# EAGLE design SIM5320_3G_Breakout (EAGLE 9.1.3)
COMPANY: ADAFRUIT INDUSTRIES; DRAWN: KTOWN; REV: A
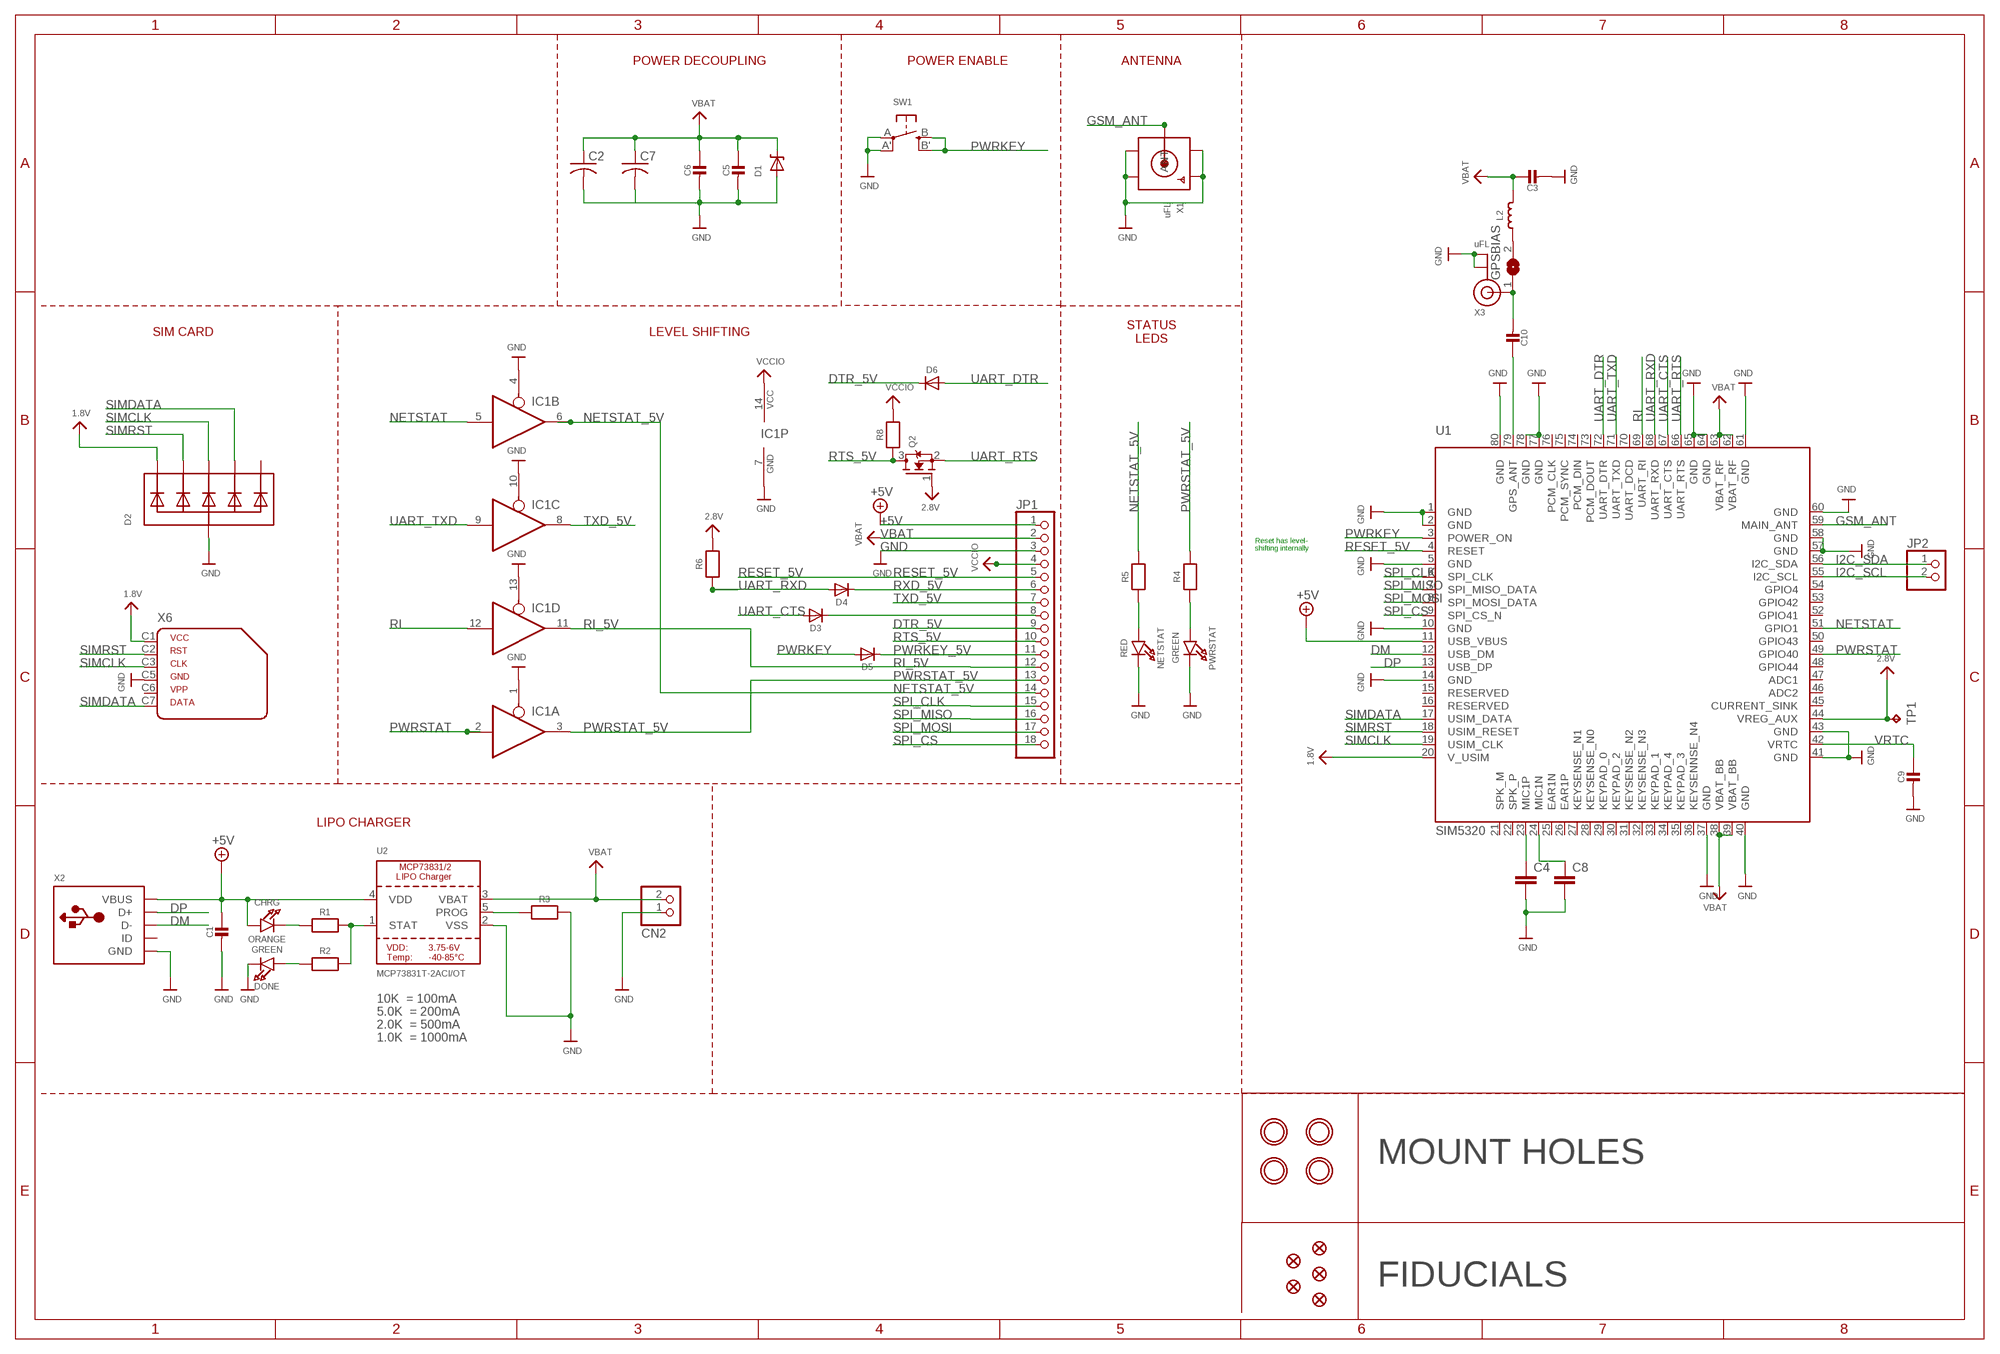
[diagram p0: schematic, sheet 1]

## Parts
C1  CAP_CERAMIC0805-NOOUTLINE  [0805-NO]
C2  C-USC1210  [C1210]
C3  CAP_CERAMIC0805-NOOUTLINE  [0805-NO]
C4  C-EUC1210  [C1210]
C5  CAP_CERAMIC0805-NOOUTLINE  [0805-NO]
C6  CAP_CERAMIC0805-NOOUTLINE  [0805-NO]
C7  C-USC1210  [C1210]
C8  C-EUC1210  [C1210]
C9  CAP_CERAMIC0805-NOOUTLINE  [0805-NO]
C10  CAP_CERAMIC0805-NOOUTLINE  [0805-NO]
CHRG  ORANGE  LED0805_NOOUTLINE  [CHIPLED_0805_NOOUTLINE]
CN2  JST_2PIN  [JSTPH2]
D1  DIODE-ZENERSOD123  [SOD-123]
D2  TVSARRAY_5LANE  [SOT363]
D3  DIODESOD-323  [SOD-323]
D4  DIODESOD-323  [SOD-323]
D5  DIODESOD-323  [SOD-323]
D6  DIODESOD-323  [SOD-323]
DONE  GREEN  LED0805_NOOUTLINE  [CHIPLED_0805_NOOUTLINE]
FID1  FIDUCIAL""  [FIDUCIAL_1MM]
FID2  FIDUCIAL""  [FIDUCIAL_1MM]
FID3  FIDUCIAL""  [FIDUCIAL_1MM]
FID4  FIDUCIAL""  [FIDUCIAL_1MM]
FID5  FIDUCIAL""  [FIDUCIAL_1MM]
GPSBIAS  SOLDERJUMPER  [SOLDERJUMPER_ARROW_NOPASTE]
IC1  74ABT125PW  [TSSOP14]
JP1  HEADER-1X18  [1X18_ROUND70]
JP2  HEADER-1X2ROUND  [1X02_ROUND]
L2  INDUCTOR_0805MP  [_0805MP]
NETSTAT  RED  LED0805_NOOUTLINE  [CHIPLED_0805_NOOUTLINE]
PWRSTAT  GREEN  LED0805_NOOUTLINE  [CHIPLED_0805_NOOUTLINE]
Q2  MOSFET-NWIDE  [SOT23-WIDE]
R1  RESISTOR0805_NOOUTLINE  [0805-NO]
R2  RESISTOR0805_NOOUTLINE  [0805-NO]
R3  RESISTOR0805_NOOUTLINE  [0805-NO]
R4  RESISTOR0805_NOOUTLINE  [0805-NO]
R5  RESISTOR0805_NOOUTLINE  [0805-NO]
R6  RESISTOR0805_NOOUTLINE  [0805-NO]
R8  RESISTOR0805_NOOUTLINE  [0805-NO]
SW1  SWITCH_TACT_SMT4.6X2.8  [BTN_KMR2_4.6X2.8]
TP1  TPTP11R  [TP11R]
U1  SIM5320  GSM_SIM5320_LITERAL  [SIM5320]
U2  MCP73831T-2ACI/OT  MCP73831/2  [SOT23-5]
U$32  MOUNTINGHOLE2.5  [MOUNTINGHOLE_2.5_PLATED]
U$33  MOUNTINGHOLE2.5  [MOUNTINGHOLE_2.5_PLATED]
U$34  MOUNTINGHOLE2.5  [MOUNTINGHOLE_2.5_PLATED]
U$43  MOUNTINGHOLE2.5  [MOUNTINGHOLE_2.5_PLATED]
X1  uFL  SMACONNECTOR_EDGE_UFL  [SMA_EDGELAUNCH_UFL]
X2  USBMICRO_20329  [4UCONN_20329]
X3  uFL  ANTENNA_U.FL  [U.FL]
X6  SIM_LOCKAMPHENOL  [C707_10M006_512_2]

## Nets
1.8V: D2.1(C1) U1.20(V_USIM) X6.C1
2.8V: Q2.1(G) R6.2 TP1.TP U1.44(VREG_AUX)
+5V: C1.1 CHRG.A JP1.1 U1.11(USB_VBUS) U2.4(VDD) X2.VBUS
CTS_5V: D3.C JP1.8
DM: U1.12(USB_DM) X2.D-
DP: U1.13(USB_DP) X2.D+
DTR_5V: D6.C JP1.9
GND: C1.2 C2.2 C3.2 C4.2 C5.2 C6.2 C7.2 C8.2 C9.2 CN2.1 D1.A D2.2(A) DONE.C IC1.1(A:OE) IC1.4(B:OE) IC1.7(P:GND) IC1.10(C:OE) IC1.13(D:OE) JP1.3 NETSTAT.C PWRSTAT.C R3.2 SW1.A'(P1) SW1.A(P) U1.1(GND) U1.2(GND) U1.5(GND) U1.10(GND) U1.14(GND) U1.37(GND) U1.40(GND) U1.41(GND) U1.43(GND) U1.57(GND) U1.58(GND) U1.60(GND) U1.61(GND) U1.64(GND) U1.65(GND) U1.77(GND) U1.78(GND) U1.80(GND) U2.2(VSS) X1.GND@1(GND1) X1.GND@2(GND2) X1.GND@3(GND3) X1.GND@4(GND4) X2.BASE@1(GND) X2.BASE@2(GND) X2.GND X2.SPRT@1(GND) X2.SPRT@2(GND) X2.SPRT@3(GND) X2.SPRT@4(GND) X3.1(GND) X3.2(GND) X6.C5
GSM_ANT: U1.59(MAIN_ANT) X1.P(ANT)
I2C_SCL: JP2.2 U1.55(I2C_SCL)
I2C_SDA: JP2.1 U1.56(I2C_SDA)
N$1: CHRG.C R1.1
N$2: R1.2 R2.2 U2.1(STAT)
N$3: C10.2 GPSBIAS.1 X3.3(SIGNAL)
N$4: PWRSTAT.A R4.1
N$5: R3.1 U2.5(PROG)
N$6: DONE.A R2.1
N$7: C10.1 U1.79(GPS_ANT)
N$8: C4.1 U1.23(MIC1P)
N$9: NETSTAT.A R5.1
N$10: C8.1 U1.24(MIC1N)
N$31: GPSBIAS.2 L2.1
NETSTAT: IC1.5(B:I) U1.51(GPIO1)
NETSTAT_5V: IC1.6(B:O) JP1.14 R5.2
PWRKEY: D5.A SW1.B'(S1) SW1.B(S) U1.3(POWER_ON)
PWRKEY_5V: D5.C JP1.11
PWRSTAT: IC1.2(A:I) U1.49(GPIO40)
PWRSTAT_5V: IC1.3(A:O) JP1.13 R4.2
RESET_5V: JP1.5 U1.4(RESET)
RI: IC1.12(D:I) U1.69(UART_RI)
RI_5V: IC1.11(D:O) JP1.12
RTS_5V: JP1.10 Q2.3(D) R8.1
RXD_5V: D4.C JP1.6
SIMCLK: D2.4(C3) U1.19(USIM_CLK) X6.C3
SIMDATA: D2.5(C4) U1.17(USIM_DATA) X6.C7
SIMRST: D2.3(C2) U1.18(USIM_RESET) X6.C2
SPI_CLK: JP1.15 U1.6(SPI_CLK)
SPI_CS: JP1.18 U1.9(SPI_CS_N)
SPI_MISO: JP1.16 U1.7(SPI_MISO_DATA)
SPI_MOSI: JP1.17 U1.8(SPI_MOSI_DATA)
TXD_5V: IC1.8(C:O) JP1.7
UART_CTS: D3.A U1.67(UART_CTS)
UART_DTR: D6.A U1.72(UART_DTR)
UART_RTS: Q2.2(S) U1.66(UART_RTS)
UART_RXD: D4.A R6.1 U1.68(UART_RXD)
UART_TXD: IC1.9(C:I) U1.71(UART_TXD)
VBAT: C2.1 C3.1 C5.1 C6.1 C7.1 CN2.2 D1.C JP1.2 L2.2 U1.38(VBAT_BB) U1.39(VBAT_BB) U1.62(VBAT_RF) U1.63(VBAT_RF) U2.3(VBAT)
VCCIO: IC1.14(P:VCC) JP1.4 R8.2
VRTC: C9.1 U1.42(VRTC)
Unconnected: D2.6(C5) U1.15(RESERVED) U1.16(RESERVED) U1.21(SPK_M) U1.22(SPK_P) U1.25(EAR1N) U1.26(EAR1P) U1.27(KEYSENSE_N1) U1.28(KEYSENSE_N0) U1.29(KEYPAD_0) U1.30(KEYPAD_2) U1.31(KEYSENSE_N2) U1.32(KEYSENSE_N3) U1.33(KEYPAD_1) U1.34(KEYPAD_4) U1.35(KEYPAD_3) U1.36(KEYSENNSE_N4) U1.45(CURRENT_SINK) U1.46(ADC2) U1.47(ADC1) U1.48(GPIO44) U1.50(GPIO43) U1.52(GPIO41) U1.53(GPIO42) U1.54(GPIO4) U1.70(UART_DCD) U1.73(PCM_DOUT) U1.74(PCM_DIN) U1.75(PCM_SYNC) U1.76(PCM_CLK) X2.ID X6.C6

## Notes on the sheet
- POWER DECOUPLING | POWER ENABLE | ANTENNA
- SIM CARD | LEVEL SHIFTING
- STATUS
  LEDS
- Reset has level-
  shifting internally
- LIPO CHARGER
- 10K  = 100mA
- 5.0K  = 200mA
- 2.0K  = 500mA
- 1.0K  = 1000mA
- MOUNT HOLES
- FIDUCIALS

## Library data of the parts
C1 C3 C5 C6 C9 C10 = microbuilder:CAP_CERAMIC: Ceramic Capacitors For new designs, use the packages preceded by an '_' character since they are more reliable: The following footprints should be used on most boards: _0402 - Standard footprint for regular board layouts _0603 - Standard footprint for regular board layouts _0805 - Standard footprint for regular board layouts _1206 - Standard footprint for regular board layouts For extremely tight-pitch boards where space is at a premium, the following 'micro-pitch' footprints can be used (smaller pads, no silkscreen outline, etc.): _0402MP - Micro-pitch footprint for very dense/compact boards _0603MP - Micro-pitch footprint for very dense/compact boards _0805MP - Micro-pitch footprint for very dense/compact boards _1206MP - Micro-pitch footprint for very dense/compact boards
C2 C7 = rcl:C-US: CAPACITOR, American symbol
C4 C8 = rcl:C-EU: CAPACITOR, European symbol; SPICEPREFIX: C
CHRG DONE NETSTAT PWRSTAT = microbuilder:LED: LED 0603 - 0603 Surface Mount Package 2mA: Green LED - Low Power (3.9mcd, 2ma, 1.7Vf) - Digikey: 475-2709-2-ND Orange LED - Low Power (9.8mcd, 2ma, 1.8Vf) - Digikey: 475-1194-2-ND Red LED - Low Power (5mcd, 2ma, 1.8Vf) - Digikey: 475-1195-2-ND Yellow LED - Low Power (7mcd, 2ma, 1.8Vf) - Digikey: 475-1196-2-ND 5mA: Blue LED - Low Power (17mcd, 5ma, 2.9Vf) - Digikey: LNJ937W8CRACT-ND 0805 - 0805 Surface Mount Package 2mA: Red LED (8.8mcd, 2mA, 1.8Vf, Clear) - Low Power [Digikey: 475-2510-1-ND] Green LED (5mcd, 2mA, 1.8Vf, Clear) - Low Power [Digikey: 475-2730-1-ND] Yellow LED (11.3mcd, 2mA, 1.8Vf, Clear) - Low Power [Digikey: 475-2555-1-ND] 20mA: Red LED (104mcd, 20mA, Diffused) - LS R976 [Digikey: 475-1278-6-ND] Red LED (12mcd, 20mA, 2.0Vf, Clear) - APT2012EC [Digikey: 754-1128-1-ND] Green LED (15mcd, 20mA, 2.2Vf, Clear) - APT2012GC [Digikey: 754-1131-1-ND] Orange LED (160mcd, 20mA, 2.1Vf, Clear) - APT2012SECK [Digikey: 754-1130-1-ND] 1206 - 1206 Surface Mount Package Green LED (26mcd, 20mA, Diffused) - LG N971 [Digikey: 475-1407-6-ND] Red LED (15mcd, 20mA, Diffused) - LH N974 [Digikey: 475-1416-6-ND] Cree - Cree High-Power Surface Mount LEDs XPEBWT-L1-0000-00D50 - White 111lm 350mA 2.9Vf 6200K 110° XTEAWT-00-0000-00000LEE3 - White 114lm 350mA 2.85Vf 5000K 115° Everlight - Everlight 45-21 Series Surface Mount LEDs 45-21/QK2C-B2832AC2CB2/2T - Warm White 2000mcd 20mA 3.25Vf 3050K 120° 45-21/LK2C-B38452C4CB2/2T - Nuetral White 2000mcd 20mA 3.25Vf 4150K 120° 45-21/LK2C-B50634C6CB2/2T - Cold White 2200mcd 20mA 3.25Vf 5650K 120° PLCC2 Reverse Mount LS T77K-J1L2-1-0-2-R18-Z - Red 11.25mcd 2mA 1.8Vf 630nm 120° LO T77K-L1M2-24-Z - Orange 19.6mcd 2mA 1.8Vf 606nm 120° LY T77K-K2M1-26-Z - Yellow 15.7mcd 2mA 1.8Vf 587nm 120°
CN2 = microbuilder:JST_2PIN: JST 2-Pin Right-Angle Connector PH-Series - 4UConnector: 17311 SH-Series - 4UConnector: 07278
D1 = microbuilder:DIODE-ZENER: Zener Diode SMA: 30V 1W Zener Diode, 1.2Vf - Digikey: SMAZ30-FDICT-ND
D2 = microbuilder:TVSARRAY_5LANE: Voltage Transient Suppressor Array SOT363 SMF05C - 100W 5V: Digikey - SMF05CT1GOSCT-ND
D3-D6 = microbuilder:DIODE: Diode SMA Model Volts Amps Type Vf Ir Digikey # Notes SSA34-E3 40V 3A Schottky 480mV @ 3A 200uA @ 40V SSA34-E3/61TGITR-ND CDBA120-G 20V 1A Schottky 500mV @ 1A 500uA @ 20V 641-1014-6-ND REEL MBRA210 10V 2A Schottky 350mV @ 2A 700uA @ 10V MBRA210LT3 SOD-123 Model Volts Amps Type Vf Ir Order # Notes BAT54T1G 30V 200mA Schottky 800mV @ 200mA 2uA @ 25V BAT54T1GOSTR-ND B0530W 30V 500mA Schottky 430mV @ 500mA 130uA @ 30V B0530W-FDICT-ND REEL MBR120 20V 1A Schottky 340mV @ 1A MBR120VLSFT1GOSCT-ND SOD-323 Model Volts Amps Type Vf Ir Order # Notes PMEG2005EJ 20V 500mA Schottky 355mV @ 500mA 568-4110-1-ND ZLLS410 10V 570mA Schottky 380mV @ 570mA ZLLS410CT-ND 1N4148WS 75V 150mA Silicon/Simple 1V 1N4148WSFSCT-ND REEL SOD-523 Model Volts Amps Type Vf Ir Order # Notes BAT54XV2 30V 200mA Schottky 0.8V @ 100mA BAT54XV2CT-ND TB751S 30V 30mA Schottky RB751S-40TE61CT-ND SOT23-R/W (R = Solder Paste/Reflow Ovens, W = Hand-Soldering) Model Volts Amps Type Vf Ir Order # Notes BAT54FILM 40V 300mA Schottky 497-7162-1-ND POWERDI-5 Model Volts Amps Type Vf Ir Order # Notes PDS560 60V 5A Schottky 670mV @ 5A 150uA @ 60V PDS560DICT-ND
FID1-FID5 = microbuilder:FIDUCIAL: Fiducial Alignment Points Various fiducial points for machine vision alignment.; BOM: EXCLUDE
GPSBIAS = microbuilder:SOLDERJUMPER: SMD Solder JUMPER Solder the two pads together to create a connection, or remove the solder to break it. REFLOW - Use this footprint for solder paste and reflow ovens. WAVE - Use this footprint for hand-soldering (larger pads). CLOSED - Has a trace between the two pads to ensure it is closed by default. The trace needs to be cut to disable the jumper, and can be closed again by creating a solder bridge between the two pads.; BOM: EXCLUDE
IC1 = 74xx-us:74*125: Quad bus BUFFER, 3-state
JP1 = microbuilder:HEADER-1X18: Header 1x18
JP2 = microbuilder:HEADER-1X2: PIN HEADER
L2 = microbuilder:INDUCTOR: Inductors 0603: 10nH Ceramic Inductor - microwire antenna/RF (Digikey: 712-1434-2-ND) 0805: 560nH Ceramic Inductor - RF (Digikey: 553-1047-1-ND) 270nH Ceramic Inductor - Q = 40@250MHz, +-5%, 1 Ohm DC Resistance (Digikey: 535-10506-2-ND) 1007 (2518 Metric) SMT: 10µH 10% 250mOhm 820mA 1007 Inductor (Digikey: 587-2189-1-ND) 22µH 10% 500mOhm 580mA 1007 Inductor (Digikey: 587-2190-1-ND) 47µH 10% 950mOhm 420mA 1007 Inductor (Digikey: 587-2191-1-ND) 47µH 5% 100mOhm 1A 1008 Inductor (Digikey: 732-1816-1-ND) 5.0x5.0mm (Taiyo Yuden NR5040 Series) 6.8µH 20% 2.3A 64mOhm Inductor (Digikey: 587-2374-2-ND) 5.0x5.0mm (TDK VLC5045 Series) 4.7µH 20% 3.3A 34mOhm Inductor (Digikey: 445-6526-1-ND) 6.8µH 20% 2.7A 46mOhm Inductor (Digikey: 445-6527-1-ND) 6.0x6.0mm (TDK VLC6045 Series) 4.7µH 20% 3.8A 27mOhm Inductor (Digikey: 445-6538-2-ND) 6.8µH 20% 3A 41mOhm Inductor (Digikey: 445-6540-1-ND) 6.2µH 30% 2.2A 45mOhm Inductor (Digikey: SRR5028-6R2YCT-ND) - Not TDK VLC6045 but footprint should match 6.0x6.0mm (TDK SLF6045 Series) 6.8uH 30% 2A 33mOhm Inductor (Digikey: 445-4572-1-ND, Mouser: 810-SLF645T6R8N2R0PF) 6.0x6.0mm (Sumida CDRH5D28 Series) 6.2uH 30% 1.8A 45mOhm Inductor (Digikey: 308-1542-1-ND) Taiyo Yuden NR3015T2R2M - 2.2uH 20% 1.5A (Digikey: 587-1648-2-ND, Mouser: 963-NR3015T2R2M) - Used with TI TPS62172 CoilCraft RFID Transponder Coil - MA5532-AE (For use with AS3935 Lightning Sensor) Vishay IHLP 1.0uH Molded Inductor - 24mOhm DCR, 5A, +/-20%, -55°C-125°C (Digikey: 541-1319-1-ND)
Q2 = microbuilder:MOSFET-N: N-Channel Mosfet LEGEND VDS: Voltage Drain-Source ID: Drain Current RDS(ON): Drain-Source On-State Resistance VGS(TH): Gate-Source Threshold Voltage CISS: Drain-Source Input Capacitance SOT-23 Name VDS ID RDS(ON) VGS(TH) CISS Order Number 2N7002E 60V 260mA 2.5 Ohm 2.5V @ 250uA 26.7pF @ 25V 2N7002ET1GOSTR-ND BSH103 30V 850mA 400 mOhm 400mV @ 1mA 83pF @ 24V BSH103,235-ND BSS138 60V 320mA 1.6 Ohm 1.5V @ 250uA 50pF @ 10V Mouser: 771-BSS138PW115 DMN2075U-7 20V 4.2A 38 mOhm 1V @ 250 uA 594.3pF @ 10V DMN2075U-7DICT-ND * BSS138 good choice for I2C level-shifting POWERPAK 1212-8 Name VDS ID RDS(ON) VGS(TH) CISS Order Number Si7308DN 60V 6A 58 mOhm 3V @ 250uA 665pF @ 15V SI7308DN-T1-E3CT-ND
R1-R6 R8 = microbuilder:RESISTOR: Resistors For new designs, use the packages preceded by an '_' character since they are more reliable: The following footprints should be used on most boards: _0402 - Standard footprint for regular board layouts _0603 - Standard footprint for regular board layouts _0805 - Standard footprint for regular board layouts _1206 - Standard footprint for regular board layouts For extremely tight-pitch boards where space is at a premium, the following 'micro-pitch' footprints can be used (smaller pads, no silkscreen outline, etc.): _0402MP - Micro-pitch footprint for very dense/compact boards _0603MP - Micro-pitch footprint for very dense/compact boards _0805MP - Micro-pitch footprint for very dense/compact boards _1206MP - Micro-pitch footprint for very dense/compact boards
SW1 = microbuilder:SWITCH_TACT_SMT: SMT Tact Switches 6x6mm - Digikey: P12940SCT-ND KMR2 (4.6x2.8mm) - Digikey: 401-1426-1-ND EVQ-PQHB55 - Light Touch, 160GF (4.5x4.5mm) - Digikey: P8090SCT-ND KMT0 - KMT021 NGJ LHS (etc.) IP68/Waterproof - Digikey: CKN10289CT-ND
TP1 = testpad:TP: Test pad
U1 = microbuilder:GSM_SIM5320_LITERAL
U2 = microbuilder:MCP73831/2: MCP73831/2 LIPO Charger VDD: 3.75 - 6V Temp -40 - 85°C Programmable Charge Rate: 15-500mA NOTE: STAT is a tri-state logic output on the MCP73831 and an open-drain output on the MCP73832. SOT23-5 with 4.2V output and tri-state logic on STAT = MCP73831T-2ACI/OT
U$32-U$34 U$43 = microbuilder:MOUNTINGHOLE: Mounting Hole For #2 screws (0.086"/2.18mm width, 0.094"/2.4mm hole) use 2.5mm; BOM: EXCLUDE
X1 = microbuilder:SMACONNECTOR: SMA Connector 90° DIP SMA Connector, 50 Ohm (4UConnector: 07259)
X2 = microbuilder:USB: USB Connectors USBMINIB - Surface Mount Female Mini-B USB Connector 4UConnector: 06564
X3 = microbuilder:ANTENNA_U.FL: U.FL Antenna Connector
X6 = microbuilder:SIM_LOCK: C707A SIMLOCK® 2.5 mm with wide solder tails Source: Data sheet <http://www.amphenol.info/downloads/C707_10M006_512_2.pdf>; OC_FARNELL: unknown; OC_NEWARK: unknown

## Board
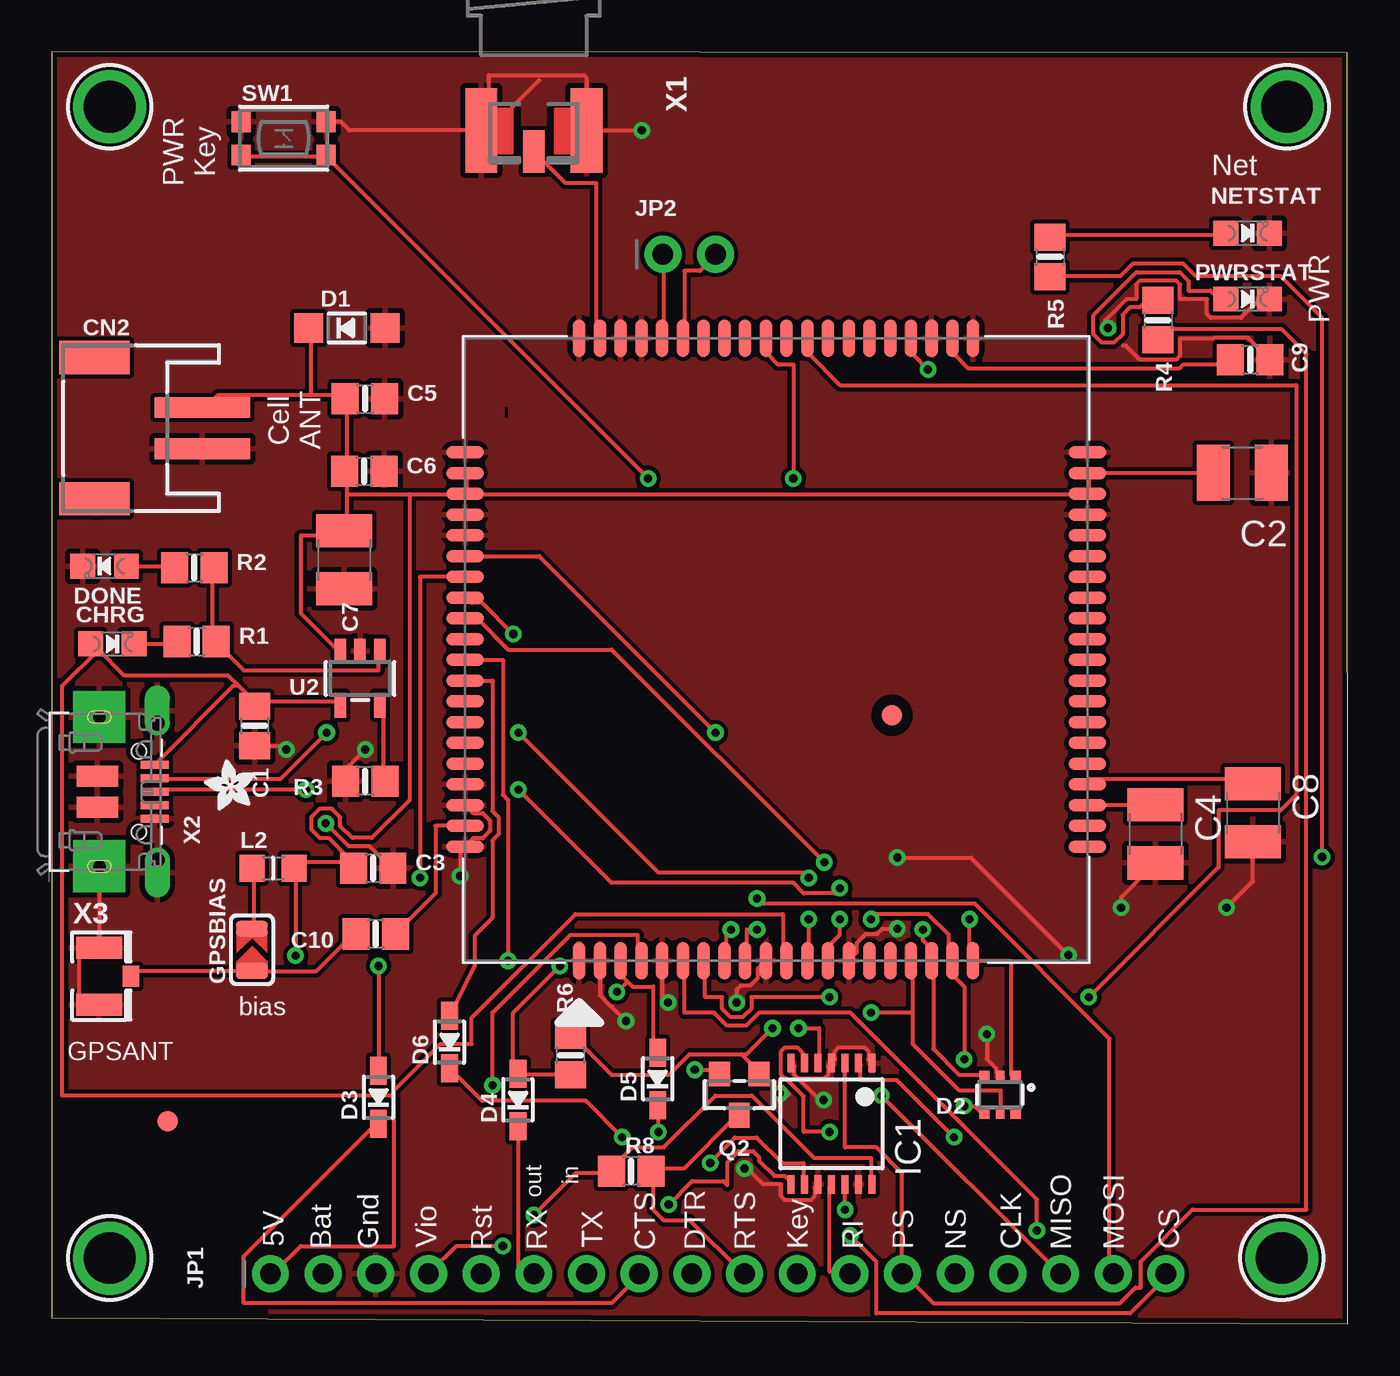
[diagram p1: board, top side]
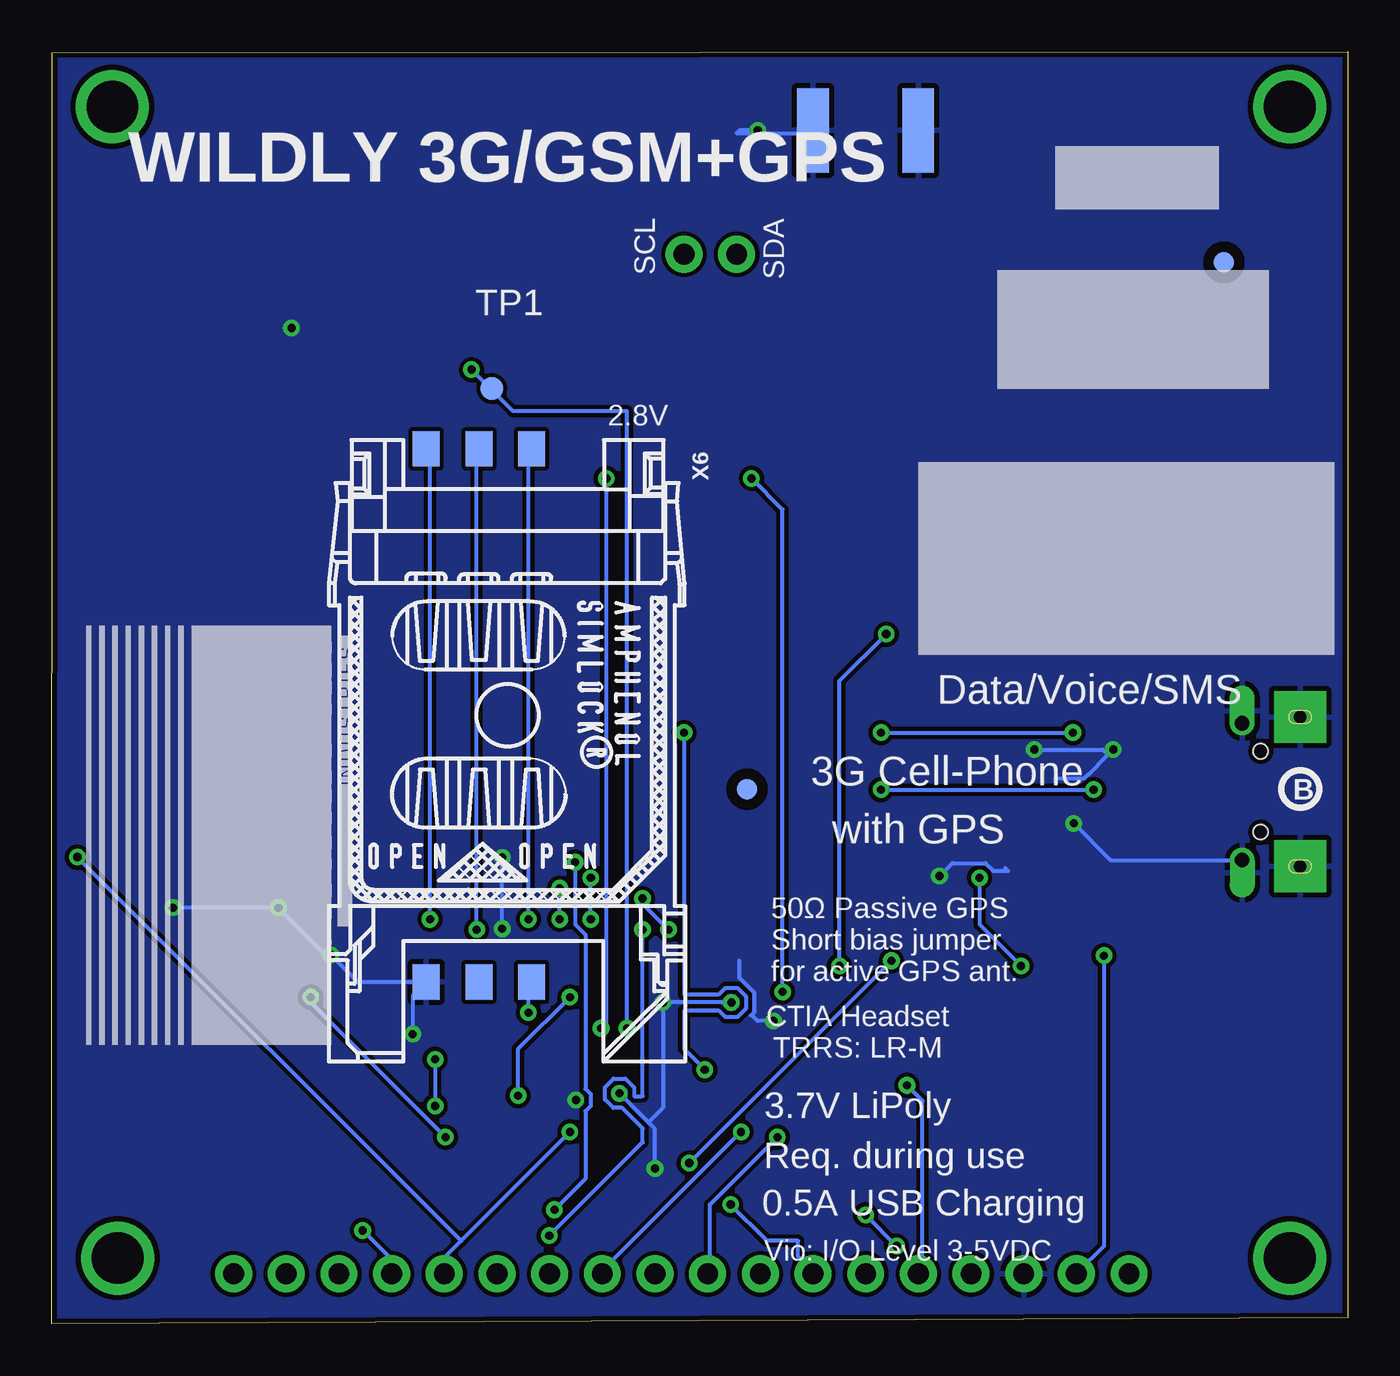
[diagram p2: board, bottom side, seen from below]

Size 62.48 x 61.32 mm. Coordinates in mm from the lower left corner, seen from the top.
Outline: 0,61.32 0,0.29 62.48,0 62.48,31.24 62.46,31.52 62.46,61.27 0,61.32
Copper layers (1*16): Top 0.035mm / dielectric 1.5mm / Bottom 0.035mm
Design rules "adafruit *": minimum track width 8mil, minimum drill 15.5mil, track to track 8mil, track to pad 8mil, pad to pad 8mil, via to via 8mil, smd to smd 8mil, copper to edge 10mil, drill to drill 8mil, minimum pad ring 10mil, minimum via ring 8mil, stop-mask expansion 2mil, vias tented up to drill 20mil, thermal gap 10mil
tRestrict: area 13.7,34.9 to 14.2,35.1; area 13.7,21.8 to 14.2,22; area 19.9,13.7 to 20.1,14.2; area 21.8,43.7 to 22,44.2

### Footprints (pad centres in the part's own frame; a part is rotated, then mirrored left to right if it is on the bottom)
0805-NO = smd 1.3 x 1.5: 1 -0.95,0; 2 0.95,0
C1210 = smd 1.6 x 2.7: 1 -1.4,0; 2 1.4,0
CHIPLED_0805_NOOUTLINE = smd 1.2 x 1.2: A 0,-1.05; C 0,1.05
JSTPH2 = smd 1 x 4.6: 1 -1,-3.7; 2 1,-3.7 | smd 1.6 x 3.4: NC1 -3.4,1.5; NC2 3.4,1.5
SOD-123 = smd 1.4 x 1.4: A 1.85,0; C -1.85,0
SOT363 = smd 0.5 x 0.5: 1 -0.75,-0.9; 3 0.75,-0.9; 4 0.75,0.9; 6 -0.75,0.9 | smd 0.4 x 0.5: 2 0,-0.9; 5 0,0.9
SOD-323 = smd 1.35 x 0.8: A 1.27,0; C -1.27,0
FIDUCIAL_1MM = smd 1 x 1: 1 0,0
SOLDERJUMPER_ARROW_NOPASTE = smd 0.762 x 1.524: 1 -1.016,0; 2 1.016,0
TSSOP14 = smd 0.35 x 0.9: 1 -1.95,-2.925; 2 -1.3,-2.925; 3 -0.65,-2.925; 4 0,-2.925; 5 0.65,-2.925; 6 1.3,-2.925; 7 1.95,-2.925; 8 1.95,2.925; 9 1.3,2.925; 10 0.65,2.925; 11 0,2.925; 12 -0.65,2.925; 13 -1.3,2.925; 14 -1.95,2.925
1X18_ROUND70 = drill 1 pad 1.778: 1 -21.59,0; 2 -19.05,0; 3 -16.51,0; 4 -13.97,0; 5 -11.43,0; 6 -8.89,0; 7 -6.35,0; 8 -3.81,0; 9 -1.27,0; 10 1.27,0; 11 3.81,0; 12 6.35,0; 13 8.89,0; 14 11.43,0; 15 13.97,0; 16 16.51,0; 17 19.05,0; 18 21.59,0
1X02_ROUND = drill 1 pad 1.778: 1 -1.27,0; 2 1.27,0
_0805MP = smd 1.2 x 1.3: 1 -1.016,0; 2 1.016,0
SOT23-WIDE = smd 1 x 1.2: 1 -0.95,-1; 2 0.95,-1; 3 0,1
BTN_KMR2_4.6X2.8 = smd 0.9 x 1: A 2.05,0.8; A' -2.05,0.8; B 2.05,-0.8; B' -2.05,-0.8
TP11R = smd 1.1 x 1.1: TP 0,0
SIM5320 = smd 1.8 x 0.6: 1 -15,9.5; 2 -15,8.5; 3 -15,7.5; 4 -15,6.5; 5 -15,5.5; 6 -15,4.5; 7 -15,3.5; 8 -15,2.5; 9 -15,1.5; 10 -15,0.5; 11 -15,-0.5; 12 -15,-1.5; 13 -15,-2.5; 14 -15,-3.5; 15 -15,-4.5; 16 -15,-5.5; 17 -15,-6.5; 18 -15,-7.5; 19 -15,-8.5; 20 -15,-9.5; 41 15,-9.5; 42 15,-8.5; 43 15,-7.5; 44 15,-6.5; 45 15,-5.5; 46 15,-4.5; 47 15,-3.5; 48 15,-2.5; 49 15,-1.5; 50 15,-0.5; 51 15,0.5; 52 15,1.5; 53 15,2.5; 54 15,3.5; 55 15,4.5; 56 15,5.5; 57 15,6.5; 58 15,7.5; 59 15,8.5; 60 15,9.5 | smd 0.6 x 1.8: 21 -9.5,-15; 22 -8.5,-15; 23 -7.5,-15; 24 -6.5,-15; 25 -5.5,-15; 26 -4.5,-15; 27 -3.5,-15; 28 -2.5,-15; 29 -1.5,-15; 30 -0.5,-15; 31 0.5,-15; 32 1.5,-15; 33 2.5,-15; 34 3.5,-15; 35 4.5,-15; 36 5.5,-15; 37 6.5,-15; 38 7.5,-15; 39 8.5,-15; 40 9.5,-15; 61 9.5,15; 62 8.5,15; 63 7.5,15; 64 6.5,15; 65 5.5,15; 66 4.5,15; 67 3.5,15; 68 2.5,15; 69 1.5,15; 70 0.5,15; 71 -0.5,15; 72 -1.5,15; 73 -2.5,15; 74 -3.5,15; 75 -4.5,15; 76 -5.5,15; 77 -6.5,15; 78 -7.5,15; 79 -8.5,15; 80 -9.5,15
SOT23-5 = smd 0.55 x 1.2: 1 -0.95,-1.3; 2 0,-1.3; 3 0.95,-1.3; 4 0.95,1.3; 5 -0.95,1.3
MOUNTINGHOLE_2.5_PLATED = drill 2.5 pad 3.2: P$1 0,0
SMA_EDGELAUNCH_UFL = smd 4.064 x 1.524: GND@1 2.032,-2.54; GND@2 2.032,2.54 | smd 4.064 x 1.524 bottom: GND@3 2.032,2.54; GND@4 2.032,-2.54 | smd 2.032 x 1.016: P 3.048,0
4UCONN_20329 = smd 1 x 2: BASE@1 -0.75,-2; BASE@2 0.75,-2 | smd 0.4 x 1.35: D+ 0,0.775; D- -0.65,0.775; GND 1.3,0.775; ID 0.65,0.775; VBUS -1.3,0.775 | drill 0.7 offset: SPRT@1 -3.3,0.9; SPRT@2 3.3,0.9 | drill 0.6 pad 2.5 square: SPRT@3 -3.6,-1.9; SPRT@4 3.6,-1.9 | hole 0.7: -1.95,0; 1.95,0
U.FL = smd 2.2 x 1.05: 1 0,1.375; 2 0,-1.375 | smd 0.8 x 1: 3 1.525,0
C707_10M006_512_2 = smd 1.7 x 1.3: C1 -12.85,-3.915; C2 -12.85,-1.375; C3 -12.85,1.165; C5 12.85,-3.915; C6 12.85,-1.375; C7 12.85,1.165

### Placement (x,y rotation side)
C1  9.78,28.83 270 top
C2  57.4,41.02 0 top
C3  15.49,21.97 0 top
C4  53.21,23.62 270 top
C5  15.1,44.59 0 top
C6  15.07,41.1 0 top
C7  14.1,36.83 270 top
C8  57.91,24.64 270 top
C9  57.78,46.48 0 top
C10  15.62,18.8 180 top
CHRG  2.92,32.78 270 top
CN2  3.56,43.18 90 top
D1  14.22,48.01 0 top
D2  45.72,11.05 180 top
D3  15.75,10.92 90 top
D4  22.48,10.79 90 top
D5  29.21,11.81 90 top
D6  19.18,13.59 90 top
DONE  2.55,36.53 90 top
FID1  40.51,29.34 0 top
FID2  2.16,39.75 0 top
FID3  5.59,9.78 0 top
FID4  5.97,51.18 0 bottom
FID5  28.96,25.78 0 bottom
GPSBIAS  9.65,18.03 90 top
IC1  37.59,9.65 180 top
JP1  32.13,2.41 0 top
JP2  30.73,51.56 0 top
L2  10.67,21.97 0 top
NETSTAT  57.66,52.58 270 top
PWRSTAT  57.66,49.4 270 top
Q2  33.15,11.05 180 top
R1  6.99,32.89 0 top
R2  6.87,36.45 0 top
R3  15.11,26.16 180 top
R4  53.34,48.39 270 top
R5  48.13,51.43 270 top
R6  25.02,12.95 90 top
R8  27.94,7.37 180 top
SW1  11.18,57.15 0 top
TP1  41.27,45.09 0 bottom
U1  34.92,32.51 90 top
U2  14.86,31.12 180 top
U$21  [ADAFRUIT_2.5MM]  9.78,24.77 90 top
U$25  [PCBFEAT-REV-040]  2.29,25.78 0 bottom
U$26  [FONA_LOGO]  19.94,32.64 0 bottom
U$32  59.31,3.17 0 top
U$33  59.56,58.67 90 top
U$34  2.79,58.67 90 top
U$36  [ADAFRUIT_5MM]  14.86,45.47 0 bottom
U$42  [ADAFRUIT_TEXT_20MM]  48.01,13.59 90 bottom
U$43  2.79,3.17 0 top
X1  23.24,59.56 270 top
X2  4.19,25.65 270 top
X3  2.29,16.76 0 top
X6  40.51,29.34 270 bottom

### Tracks (layer width: path | path; a pad name or v marks a point on that pad's centre or on a via)
1.8V  (via drill 0.39)
  Top 0.203: D2.1 46.25,12 46.25,17.5 44.5,17.5 U1.20 44.25,17.75 v44.25,19.5
  Bottom 0.203: v44.25,19.5 44.25,42 X6.C1
2.8V  (via drill 0.39)
  Top 0.203: v42.25,46 41.5,46.75 41.5,47.5 U1.44 | 33.25,13 34,12.25 Q2.1 | 33.25,13 30.75,13 29.75,12 27,12 25.25,13.75 R6.2 | v34.75,14.25 33.5,13 33.25,13
  Bottom 0.203: v42.25,46 41.5,45.25 TP1.TP 41.25,45 40.25,44 34.75,44 v34.75,14.25
+5V
  Top 0.203: U2.4 13.75,30 10,30 C1.1 9.75,30 9,30.75 | 2.25,32.5 3.5,31.25 8.5,31.25 9,30.75 | 2.25,32.5 2,32.75 CHRG.A 2.25,32.5 | 9,30.75 8.75,30.75 5,27 X2.VBUS | 16.5,11 16.5,3.75 12,3.75 10.75,2.5 JP1.1 | 16.5,11 16.5,11.25 18.75,13.5 20.25,13.5 20.25,14.75 25.25,19.75 35.25,19.75 35.25,17.75 U1.11 | 2.25,32.5 0.5,30.75 0.5,11 16.5,11
CTS_5V
  Top 0.203: D3.C 15.5,9.5 9.25,3.25 9.25,1 27,1 28.25,2.25 JP1.8
DM  (via drill 0.39)
  Top 0.203: v13.25,28.5 11,26.25 5,26.25 X2.D- | v22.5,28.5 29.25,21.75 36.25,21.75 v36.5,21.5 | v36.5,19.5 36.5,17.75 U1.12
  Bottom 0.203: v22.5,28.5 v13.25,28.5 | v36.5,19.5 v36.5,21.5
DP  (via drill 0.39)
  Top 0.203: v12.25,25.75 5,25.75 X2.D+ | v22.5,25.75 27,21.25 35.75,21.25 36.25,20.75 37.75,20.75 v38,21 | v38,19.5 38,18.75 37.5,18.25 37.5,17.75 U1.13
  Bottom 0.203: v22.5,25.75 v12.25,25.75 | v38,19.5 v38,21
DTR_5V  (via drill 0.39)
  Top 0.203: v27.5,9 25.75,10.75 20.75,10.75 19.25,12.25 D6.C
  Bottom 0.203: v27.5,9 30.75,5.75 30.75,2.5 JP1.9
GND  (via drill 0.39)
  Top 0.203: C4.2 51.56,20.57 v51.56,20.07 | v56.64,20.07 57.91,21.34 C8.2 | U1.14 38.82,17.91 38.82,18.36 39.26,18.8 39.79,18.8 40.04,19.05 v40.77,19.05 | v40.77,22.48 44.32,22.48 v49.02,17.78 | IC1.1 39.37,12.75 39.37,13.15 39.19,13.33 37.94,13.33 37.76,13.15 37.76,12.75 IC1.4 37.42,12.41 37.42,12 37.24,11.82 35.99,11.82 | D2.2 45.52,12.14 45.52,12.32 45.09,12.76 v45.09,13.97 | X2.SPRT@4 X3.1 1.84,17.69 1.35,17.69 1.29,17.63 1.29,15.9 1.35,15.84 2.29,15.84 X3.2 | v19.68,21.59 19.68,22.77 U1.80 20.32,23.41 20.78,23.41 21.13,23.76 21.13,24.26 20.78,24.62 20.32,24.62 U1.78 | C9.2 57.68,47.54 56.06,47.54 56.02,47.5 54.4,47.5 54.4,46.66 54.22,46.48 52.46,46.48 51.79,47.16 51.65,47.16 | PWRSTAT.C 58.24,49.4 57.33,48.5 55.88,48.5 55.7,48.68 55.7,49.4 54.4,49.4 54.4,50.11 54.22,50.29 52.46,50.29 52.28,50.11 52.28,49.4 51.82,49.4 50.8,48.39 50.93,48.26 v50.93,48.01 50.93,47.88 | 35.99,11.82 35.81,12 35.81,12.41 IC1.7 | IC1.10 36.77,6.56 36.77,6.15 36.59,5.97 35.34,5.97 35.16,6.15 35.16,6.73 34.29,6.73 33.53,7.49 v33.4,7.49 | v35.12,11.11 35.5,11.11 | 35.56,11.05 35.5,11.11 | 35.5,11.11 35.43,11.18 | v33.02,15.49 33.02,16.11 33.22,16.31 33.68,16.31 34.03,16.66 34.03,17.12 U1.10 | U1.5 29.43,15.79 v29.72,15.49 | C1.2 11.11,27.88 v11.3,27.69 | v27.69,14.61 26.99,15.3 26.96,15.3 26.43,15.83 U1.2 | SW1.A 13.93,57.95 14.35,57.53 X1.GND@1 | v13.21,24.13 14.31,23.03 15.32,23.03 16.38,21.97 C3.2 | 35.99,11.82 37.02,10.79 v37.21,10.79 | R3.2 14.16,26.74 v15.11,27.69 | 23.5,59.94 21.08,57.53 X1.GND@1 | X1.GND@1 21.08,57.91 21.08,60.2 25.65,60.2 25.78,60.07 X1.GND@2 v28.45,57.53
  Bottom 0.203: v56.64,20.07 v51.56,20.07 49.28,17.78 v49.02,17.78 47.73,16.49 X6.C5 45.09,15.83 v45.09,13.97 | v40.77,19.05 v40.77,22.48 | v19.68,21.59 19.07,22.21 17.46,22.21 17.09,21.84 16.38,21.84 16.51,21.97 | v33.4,7.49 33.4,9.4 33.72,9.72 | 33.72,9.72 v35.12,11.11 | 33.72,9.72 33.02,10.41 v33.02,15.49 v29.72,15.49 | v11.3,27.69 11.56,27.43 | 11.56,27.43 12.53,26.46 12.54,26.46 12.71,26.29 14.1,26.29 14.1,26.16 | v27.69,14.61 28.45,14.61 28.7,14.86 28.78,14.86 28.61,15.03 28.61,15.95 29.34,16.69 29.34,17.53 | v13.21,24.13 11.43,22.35 X2.SPRT@2 | v15.11,27.69 11.81,27.69 11.56,27.43 | v28.45,57.53 29.34,57.53 29.46,57.4 25.91,57.4 X1.GND@2
  pour Top: 0,61.21 0,0.25 62.74,0.25 62.74,61.21
  pour Bottom: 0,61.34 0,0.25 62.74,0.25 62.74,61.34
GSM_ANT
  Top 0.203: U1.59 26.25,47.75 26.25,55 24.75,55 X1.P
I2C_SCL
  Top 0.203: U1.55 30.5,47.75 30.5,50.75 31.25,50.75 32,51.5 JP2.2
I2C_SDA
  Top 0.203: U1.56 29.5,47.75 29.5,51.5 JP2.1
N$1
  Top 0.203: CHRG.C 4,32.75 6,32.75 R1.1
N$2
  Top 0.203: U2.1 15.75,32.25 15.75,31.5 9.25,31.5 8,32.75 R1.2 7.75,33 7.75,36.25 R2.2
N$3
  Top 0.203: X3.3 4,17 9.5,17 GPSBIAS.1 9.75,17 12.75,17 14.5,18.75 C10.2
N$4
  Top 0.203: PWRSTAT.A 56.5,49.5 56.18,49.5 55.87,49.81 54.8,49.81 54.8,50.28 54.38,50.7 52.3,50.7 50.22,48.62 50.22,47.71 50.63,47.3 51.22,47.3 51.63,47.71 51.63,48.64 51.98,49 52.45,49 52.69,49.23 52.69,49.88 53.99,49.88 53.99,49.5 53.5,49.5 R4.1
N$5
  Top 0.203: U2.5 16,29.75 16,26.25 R3.1
N$6
  Top 0.203: DONE.A 3.75,36.5 5.75,36.5 R2.1
N$7
  Top 0.203: C10.1 16.75,19 18.5,20.75 18.5,24 19.75,24 U1.79
N$8
  Top 0.203: U1.23 50,25 53,25 C4.1
N$9
  Top 0.203: NETSTAT.A 56.5,52.5 48.25,52.5 R5.1
N$10
  Top 0.203: U1.24 50,26.25 57.75,26.25 C8.1
N$31
  Top 0.203: L2.1 9.75,21.75 9.75,19.25 GPSBIAS.2
NETSTAT  (via drill 0.39)
  Top 0.203: v36,14.25 37,14.25 37,12.75 IC1.5 | v35.75,40.75 35.75,46.25 35,46.25 34.5,46.75 34.5,47.5 U1.51
  Bottom 0.203: v36,14.25 35.75,14.5 v35.75,40.75
NETSTAT_5V  (via drill 0.39)
  Top 0.203: v37.5,9.25 36.25,9.25 36.25,10.97 35.41,11.82 35.34,11.82 35.16,12 35.16,13.15 35.34,13.33 35.94,13.33 36.22,13.06 36.22,12.54 36.25,12.5 IC1.6 | v61.25,22.5 61.25,48.5 59.25,50.5 55.15,50.5 54.55,51.1 52.13,51.1 51.53,50.5 48.25,50.5 R5.2
  Bottom 0.203: 42.75,4 43.5,3.25 43.5,2.5 JP1.14 | 42.75,4 v37.5,9.25 | 42.75,4 v61.25,22.5
PWRKEY  (via drill 0.39)
  Top 0.203: SW1.B' 9.25,56.25 13,56.25 SW1.B 13.25,56.25 v28.75,40.75 | 27.75,16.5 27.5,16.75 27.5,17.5 U1.3 | 27.75,16.5 28,16.25 29,16.25 29,13.25 D5.A | 27.75,16.5 v27.25,16
  Bottom 0.203: v28.75,40.75 27.25,39.25 v27.25,16
PWRKEY_5V  (via drill 0.39)
  Top 0.203: v29.25,9.25 29.25,10.5 D5.C
  Bottom 0.203: v29.25,9.25 35.75,2.75 35.75,2.5 JP1.11
PWRSTAT  (via drill 0.39)
  Top 0.203: v43.5,9 40.75,11.75 39,11.75 39,12.47 IC1.2 | v50,15.75 56.25,22 56.25,24.75 59.25,24.75 60,25.5 60,45.25 38,45.25 36.5,46.75 36.5,47.5 U1.49
  Bottom 0.203: v43.5,9 50,15.5 v50,15.75
PWRSTAT_5V
  Top 0.203: IC1.3 38.25,12.5 38.25,8.5 39.75,8.5 41,7.25 41,2.5 JP1.13 41.25,2.25 42.5,1 51.5,1 52.25,1.75 52.5,1.75 52.5,3 55,5.5 60.5,5.5 60.5,46.75 59.31,47.94 53.94,47.94 53.5,47.5 R4.2
RESET_5V  (via drill 0.39)
  Top 0.203: v21.25,11.5 21.25,15 25,18.75 28.25,18.75 28.25,17.75 U1.4
  Bottom 0.203: v21.25,11.5 20.5,10.75 20.5,2.5 JP1.5
RI  (via drill 0.39)
  Top 0.203: v38.25,5.5 38.25,6.5 IC1.12 | v37.25,22.25 27,32.5 22,32.5 20.5,34 20,34 U1.69
  Bottom 0.203: v38.25,5.5 36.75,7 36.75,10.26 36.51,10.5 36.51,11.09 36.75,11.33 36.75,18.75 37.25,19.25 v37.25,22.25
RI_5V
  Top 0.203: IC1.11 37.5,6.5 37.5,2.5 38.25,2.5 JP1.12
RTS_5V
  Top 0.203: Q2.3 33,10 30.5,7.5 29,7.5 R8.1 29,7.25 29,5.5 29.5,5 30.75,5 33.25,2.5 JP1.10
RXD_5V
  Top 0.203: D4.C 22.5,9.5 22.5,2.5 23,2.5 JP1.6
SIMCLK  (via drill 0.39)
  Top 0.203: v44,10.5 44.5,10.5 44.75,10.25 D2.4 | v44,12.75 44,16.25 43.5,16.75 43.5,17.5 U1.19 43.25,17.75 43.25,18.75 42.25,19.76 39.75,19.76 v39.5,19.5
  Bottom 0.203: v44,12.75 v44,10.5 | v39.5,19.5 39.5,42 X6.C3
SIMDATA  (via drill 0.39)
  Top 0.203: 41.5,15 41.5,17.5 U1.17 | 41.5,15 41.5,13.5 43.75,11.25 45.75,11.25 45.75,10.25 D2.5 | 41.5,15 v39.5,15
  Bottom 0.203: v39.5,15 39.5,16.25 X6.C7
SIMRST  (via drill 0.39)
  Top 0.203: D2.3 44.75,12 43.75,12 42.5,13.25 42.5,17.5 U1.18 42.25,17.75 42.25,18.25 42,18.5 v42,19
  Bottom 0.203: v42,19 42,42 X6.C2
SPI_CLK  (via drill 0.39)
  Top 0.203: v47.5,4.5 47.5,6 38.5,15 34.1,15 33.48,14.38 32.56,14.38 31.94,15 30.5,15 30.5,17.5 U1.6
  Bottom 0.203: v47.5,4.5 46.25,3.25 46.25,2.5 JP1.15
SPI_CS  (via drill 0.39)
  Top 0.203: v34,19 33.5,19 33.5,17.75 U1.9 | v38.5,4.25 39.75,3 39.75,0.5 52,0.5 53.75,2.25 JP1.18
  Bottom 0.203: v38.5,4.25 34,8.75 34,9.42 34.98,10.41 35.41,10.41 35.82,10.82 35.82,11.4 35.41,11.82 34.82,11.82 34.41,11.4 34.41,10.98 34,10.98 v34,19
SPI_MISO  (via drill 0.39)
  Top 0.203: v40,11 48.5,2.5 JP1.16 | U1.7 31.5,17.5 31.5,15.75 32.31,15.75 32.31,15.2 32.73,14.79 33.31,14.79 33.73,15.2 33.73,15.75 v37.5,15.75
  Bottom 0.203: v37.5,15.75 40,13.25 v40,11
SPI_MOSI  (via drill 0.39)
  Top 0.203: v32.75,19 32.5,19 32.5,17.75 U1.8 | v34,20.5 34.25,20.25 44.5,20.25 51,13.75 51,2.5 JP1.17
  Bottom 0.203: v32.75,19 34,20.25 v34,20.5
TXD_5V  (via drill 0.39)
  Top 0.203: IC1.8 35.57,6.8 35.57,6.89 35.33,7.13 34.84,7.13 34.11,7.87 34.11,8.04 33.82,8.32 33.11,8.32 32.57,7.79 32.57,6.69 32.38,6.88 30.88,6.88 v29.75,5.75
  Bottom 0.203: v29.75,5.75 28,4 26.5,4 26.5,3.25 26,2.75 26,2.5 JP1.7
UART_CTS  (via drill 0.39)
  Top 0.203: v15.75,17.25 15.75,12.25 D3.A | v17.75,21.5 17.75,36 19.75,36 U1.67
  Bottom 0.203: v15.75,17.25 17.75,19.25 v17.75,21.5
UART_DTR
  Top 0.203: D6.A 20.39,17.27 20.39,18.72 21.25,19.58 21.25,23.31 21.54,23.59 21.54,24.43 21.25,24.72 21.25,31 20,31 U1.72
UART_RTS  (via drill 0.39)
  Top 0.203: v31,12.25 32,12.25 Q2.2 | v32,28.5 23.5,37 20,37 U1.66
  Bottom 0.203: v31,12.25 32,13.25 32,15.09 30.31,15.09 30.01,14.79 29.43,14.79 29.01,15.2 29.01,15.79 29.43,16.2 30.01,16.2 30.31,15.9 32,15.9 v32,28.5
UART_RXD  (via drill 0.39)
  Top 0.203: R6.1 22.5,12 D4.A 22.25,12.25 22.25,15 v24.5,17.25 | v22.25,33.25 20.75,34.75 20.25,34.75 20,35 U1.68
  Bottom 0.203: v22.25,33.25 24.5,31 v24.5,17.25
UART_TXD  (via drill 0.39)
  Top 0.203: v22,17.5 22,25.25 21.75,25.5 21.75,32 20,32 U1.71 | IC1.9 36.25,6.75 36.25,7.75 35.22,7.75 33.99,8.98 32.94,8.98 31.75,7.79 v31.75,7.75
  Bottom 0.203: v22,17.5 v31.75,7.75
VBAT  (via drill 0.39)
  Top 0.203: 50,41 50,40.25 U1.38 49.75,40 20,40 U1.63 | 50,41 56,41 C2.1 | 50,41 U1.39 | 12.5,44.75 12.5,48 D1.C | 12.5,44.75 14,44.75 C5.1 14.25,44.5 14.25,41.25 C6.1 14.25,41 14.25,40 | 14.25,22.25 12,22.25 11.75,22 L2.2 11.75,21.75 v11.75,17.75 | 14.25,22.25 14.5,22 C3.1 14.25,22.25 | U1.63 20,40.25 20,41 U1.62 | U2.3 13.75,32.5 12,34.25 12,38 14,38 C7.1 14.25,38.25 14.25,40 | 14.25,40 17.25,40 | 17.25,40 19.75,40 U1.63 | 17.25,40 17.25,25.25 15.43,23.43 14.48,23.43 13.91,24 13.91,24.42 13.5,24.84 12.92,24.84 12.5,24.42 12.5,23.84 12.92,23.43 13.34,23.43 14.25,22.51 14.25,22.25 | 12.5,44.75 8,44.75 7.5,44.25 CN2.2
  Bottom 0.203: v11.75,17.75 11.75,3.75 13,2.5 JP1.2
VCCIO  (via drill 0.39)
  Top 0.203: IC1.14 39.5,6.75 39.5,8 36.75,8 33.75,11 32,11 29.5,8.5 28,8.5 27,7.5 R8.2 26.75,7.25 25.25,7.25 v23.25,5.25 | v21.75,3.75 19.5,3.75 18.25,2.5 JP1.4
  Bottom 0.203: v23.25,5.25 v21.75,3.75
VRTC
  Top 0.203: C9.1 56.75,46.25 54.56,46.25 54.38,46.08 44.18,46.08 43.5,46.75 43.5,47.5 U1.42

### Text on the board
tPlace: PWR / Key | Net | PWR | Cell / ANT | bias | GPSANT | MISO | MOSI | out | in | CLK | 5V | Gnd | Key | CS | Bat | RI | PS | NS | Vio | Rst | RX | TX | CTS | DTR | RTS
bPlace: WILDLY 3G/GSM+GPS | SDA | SCL | 2.8V | Data/Voice/SMS | 3G Cell-Phone | with GPS | 50Ω Passive GPS / Short bias jumper / for active GPS ant. | CTIA Headset / TRRS: LR-M | 3.7V LiPoly | Req. during use | 0.5A USB Charging | Vio: I/O Level 3-5VDC